# Altium schematic sheet GLV Precharge.SchDoc
size Tabloid; SheetNumber: 5; SheetTotal: 5
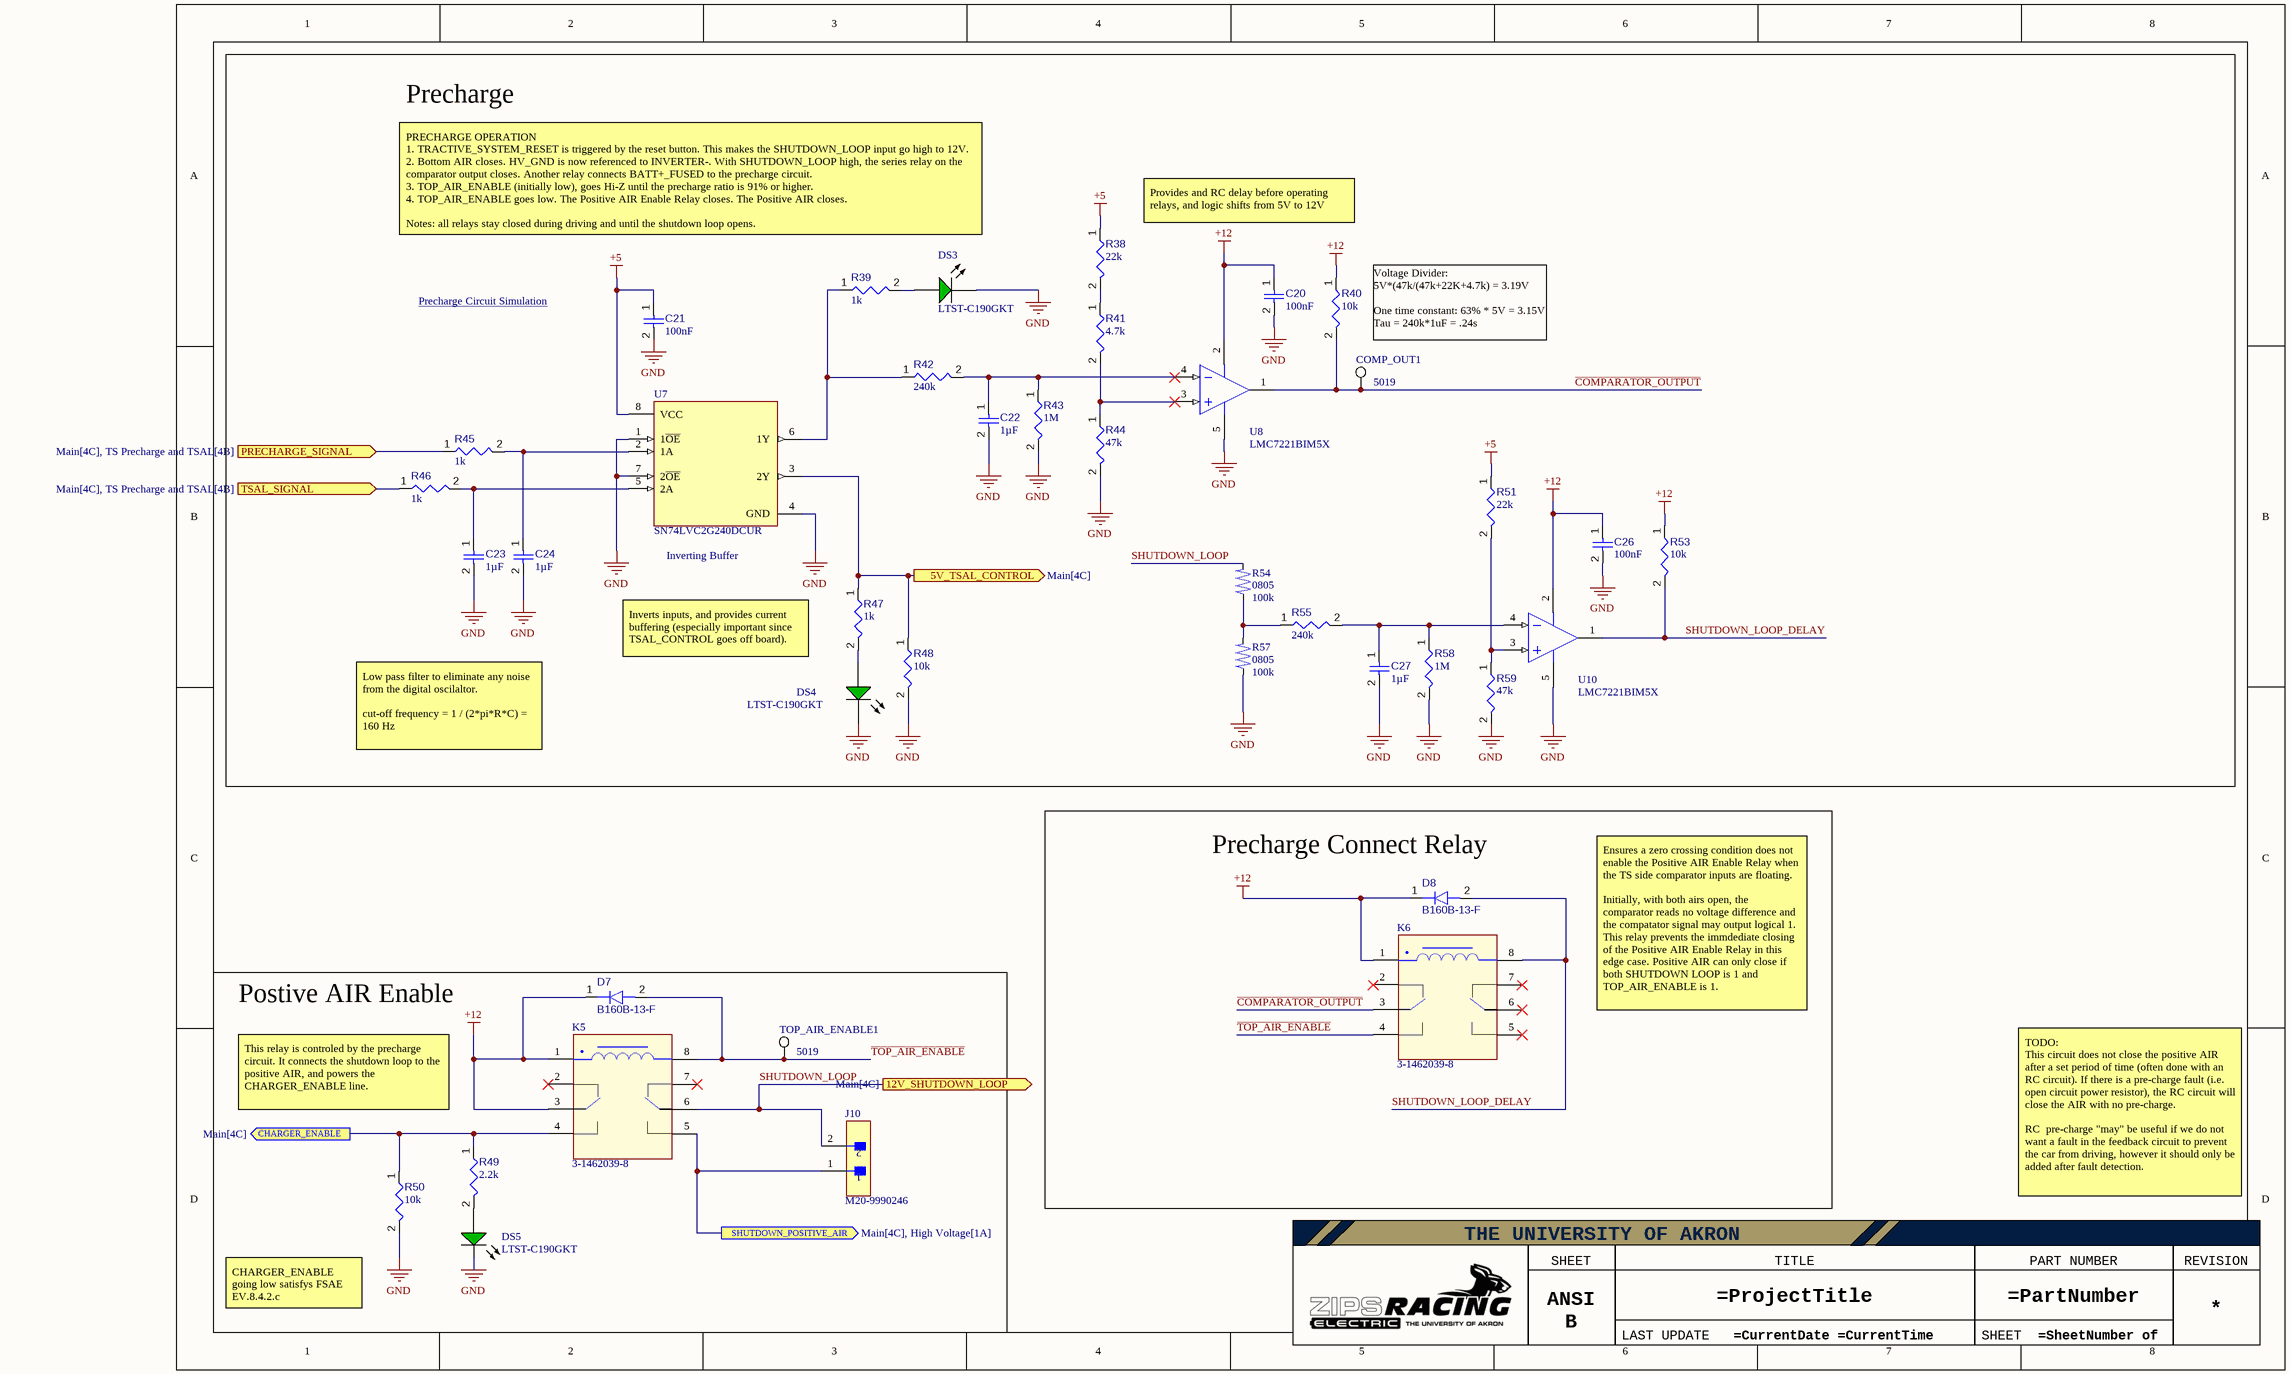
[diagram p0: GLV Precharge.SchDoc]

## Parts
C20  value 100nF  [CAPC1608X90X40NL10T20]  (hidden comment: Capacitor 100 nF +/-10% 50 V 0603)
C21  value 100nF  [CAPC1608X90X40NL10T20]  (hidden comment: Capacitor 100 nF +/-10% 50 V 0603)
C22  value 1µF  [CAPC1608X94X35NL15T15]  (hidden comment: Capacitor 1 uF +/- 10% 16 V 0603)
C23  value 1µF  [CAPC1608X94X35NL15T15]  (hidden comment: Capacitor 1 uF +/- 10% 16 V 0603)
C24  value 1µF  [CAPC1608X94X35NL15T15]  (hidden comment: Capacitor 1 uF +/- 10% 16 V 0603)
C26  value 100nF  [CAPC1608X90X40NL10T20]  (hidden comment: Capacitor 100 nF +/-10% 50 V 0603)
C27  value 1µF  [CAPC1608X94X35NL15T15]  (hidden comment: Capacitor 1 uF +/- 10% 16 V 0603)
COMP_OUT1  5019  [KSTN-5019_V]
D7  B160B-13-F  [FP-SMB-MFG]
D8  B160B-13-F  [FP-SMB-MFG]
DS3  LTST-C190GKT  [LTST-C190GKT_V]
DS4  LTST-C190GKT  [LTST-C190GKT_V]
DS5  LTST-C190GKT  [LTST-C190GKT_V]
J10  M20-9990246  [FP-M20-9990246-MFG]
K5  3-1462039-8  [FP-3-1462039-8-MFG]
K6  3-1462039-8  [FP-3-1462039-8-MFG]
R38  value 22k  [RESC1608X55X25LL10T15]  (hidden comment: Resistor 22k +/- 1% 0603 100 mW)
R39  value 1k  [RESC1608X55X25ML10T15]  (hidden comment: Resistor 1k +/-1% 0603 100 mW)
R40  value 10k  [RESC1608X55X25ML10T15]  (hidden comment: Resistor 10k +/-1% 0603 100 mW)
R41  value 4.7k  [RESC1608X55X25ML10T15]  (hidden comment: Resistor 4k7 +/-1% 0603 100 mW)
R42  value 240k  [RESC1608X55X30LL15T15]  (hidden comment: Resistor 240k +/-1% 0603 100 mW)
R43  value 1M  [RESC1608X55X25LL10T15]  (hidden comment: Resistor 1M +/- 1 % 0603 100mW)
R44  value 47k  [FP-RT0603-IPC_C]  (hidden comment: Resistor 47k +/-1% 0603 100 mW)
R45  value 1k  [RESC1608X55X25ML10T15]  (hidden comment: Resistor 1k +/-1% 0603 100 mW)
R46  value 1k  [RESC1608X55X25ML10T15]  (hidden comment: Resistor 1k +/-1% 0603 100 mW)
R47  value 1k  [RESC1608X55X25ML10T15]  (hidden comment: Resistor 1k +/-1% 0603 100 mW)
R48  value 10k  [RESC1608X55X25ML10T15]  (hidden comment: Resistor 10k +/-1% 0603 100 mW)
R49  value 2.2k  [RESC1608X55X25LL10T15]  (hidden comment: Resistor 2.2k +/-1% 0603 100mW)
R50  value 10k  [RESC1608X55X25ML10T15]  (hidden comment: Resistor 10k +/-1% 0603 100 mW)
R51  value 22k  [RESC1608X55X25LL10T15]  (hidden comment: Resistor 22k +/- 1% 0603 100 mW)
R53  value 10k  [RESC1608X55X25ML10T15]  (hidden comment: Resistor 10k +/-1% 0603 100 mW)
R54  value 100k  Footprint: 0805  [RES-0805-GENERIC]  (hidden comment: Resistor 100k 0805 1%)
R55  value 240k  [RESC1608X55X30LL15T15]  (hidden comment: Resistor 240k +/-1% 0603 100 mW)
R57  value 100k  Footprint: 0805  [RES-0805-GENERIC]  (hidden comment: Resistor 100k 0805 1%)
R58  value 1M  [RESC1608X55X25LL10T15]  (hidden comment: Resistor 1M +/- 1 % 0603 100mW)
R59  value 47k  [FP-RT0603-IPC_C]  (hidden comment: Resistor 47k +/-1% 0603 100 mW)
TOP_AIR_ENABLE1  5019  [KSTN-5019_V]
U7  SN74LVC2G240DCUR  [FP-DCU0008A-IPC_B]
U8  LMC7221BIM5X  [DBV0005A_L]
U10  LMC7221BIM5X  [DBV0005A_L]

## Blocks framed on the sheet
Precharge: C20-C24 C26 C27 COMP_OUT1 DS3 DS4 R38-R48 R51 R53-R55 R57-R59 U7 U8 U10
Precharge Connect Relay: D8 K6
Postive AIR Enable: D7 DS5 J10 K5 R49 R50 TOP_AIR_ENABLE1

## Ports
5V_TSAL_CONTROL (out, see Main[4C]), 12V_SHUTDOWN_LOOP (out, see Main[4C]), CHARGER_ENABLE (out, see Main[4C]), PRECHARGE_SIGNAL (in, see Main[4C], TS Precharge and TSAL[4B]), SHUTDOWN_POSITIVE_AIR (out, see Main[4C], High Voltage[1A]), TSAL_SIGNAL (in, see Main[4C], TS Precharge and TSAL[4B])

## Nets
+5: C21.1 R38.1 R51.1 U7.8(VCC)
+12: C20.1 C26.1 D7.1(K) D8.1(K) K5.1 K5.3 K6.1 R40.1 R53.1 U8.2(V+) U10.2(V+)
GND: C20.2 C21.2 C22.2 C23.2 C24.2 C26.2 C27.2 DS3.2(K) DS4.2(K) DS5.2(K) R43.2 R44.2 R48.2 R50.2 R57.1 R58.2 R59.2 U7.1(1~{OE}) U7.4(GND) U7.7(2~{OE}) U8.5(V-) U10.5(V-)
5V_TSAL_CONTROL: R47.1 R48.1 U7.3(2Y) ; port 5V_TSAL_CONTROL
~{COMPARATOR_OUTPUT}: COMP_OUT1.1 K6.3 R40.2 U8.1(OUT)
~{TOP_AIR_ENABLE}: D7.2(A) K5.8 K6.4 TOP_AIR_ENABLE1.1
CHARGER_ENABLE: K5.4 R49.1 R50.1 ; port CHARGER_ENABLE
PRECHARGE_SIGNAL: R45.1 ; port PRECHARGE_SIGNAL
SHUTDOWN_LOOP: J10.2 K5.6 R54.2 ; port 12V_SHUTDOWN_LOOP
SHUTDOWN_LOOP_DELAY: D8.2(A) K6.8 R53.2 U10.1(OUT)
SHUTDOWN_POSITIVE_AIR: J10.1 K5.5 ; port SHUTDOWN_POSITIVE_AIR
TSAL_SIGNAL: R46.1 ; port TSAL_SIGNAL
NetC22_1: C22.1 R42.2 R43.1 U8.4(IN-)
NetC23_1: C23.1 R46.2 U7.5(2A)
NetC24_1: C24.1 R45.2 U7.2(1A)
NetC27_1: C27.1 R55.2 R58.1 U10.4(IN-)
NetDS3_1: DS3.1(A) R39.2
NetDS4_1: DS4.1(A) R47.2
NetDS5_1: DS5.1(A) R49.2
NetR38_2: R38.2 R41.1
NetR39_1: R39.1 R42.1 U7.6(1Y)
NetR41_2: R41.2 R44.1 U8.3(IN+)
NetR51_2: R51.2 R59.1 U10.3(IN+)
NetR54_1: R54.1 R55.1 R57.2

Not connected (* = marked no-connect by the designer): K5 2* 7*; K6 2* 5* 6* 7*

## Notes on the sheet
- PRECHARGE OPERATION
  1. TRACTIVE_SYSTEM_RESET is triggered by the reset button. This makes the SHUTDOWN_LOOP input go high to 12V.
  2. Bottom AIR closes. HV_GND is now referenced to INVERTER-. With SHUTDOWN_LOOP high, the series relay on the comparator output closes. Another relay connects BATT+_FUSED to the precharge circuit.
  3. TOP_AIR_ENABLE (initially low), goes Hi-Z until the precharge ratio is 91% or higher.
  4. TOP_AIR_ENABLE goes low. The Positive AIR Enable Relay closes. The Positive AIR closes.
  Notes: all relays stay closed during driving and until the shutdown loop opens.
- Provides and RC delay before operating relays, and logic shifts from 5V to 12V
- Precharge Circuit Simulation <https://tinyurl.com/2y2tw88o>
- Voltage Divider:
  5V*(47k/(47k+22K+4.7k) = 3.19V
  One time constant: 63% * 5V = 3.15V
  Tau = 240k*1uF = .24s
- (near U7) Inverting Buffer
- Inverts inputs, and provides current buffering (especially important since TSAL_CONTROL goes off board).
- Low pass filter to eliminate any noise from the digital oscilaltor.
  cut-off frequency = 1 / (2*pi*R*C) = 160 Hz
- Ensures a zero crossing condition does not enable the Positive AIR Enable Relay when the TS side comparator inputs are floating.
  Initially, with both airs open, the comparator reads no voltage difference and the compatator signal may output logical 1. This relay prevents the immdediate closing of the Positive AIR Enable Relay in this edge case. Positive AIR can only close if both SHUTDOWN LOOP is 1 and TOP_AIR_ENABLE is 1.
- This relay is controled by the precharge circuit. It connects the shutdown loop to the positive AIR, and powers the CHARGER_ENABLE line.
- TODO:
  This circuit does not close the positive AIR after a set period of time (often done with an RC circuit). If there is a pre-charge fault (i.e. open circuit power resistor), the RC circuit will close the AIR with no pre-charge.
  RC  pre-charge "may" be useful if we do not want a fault in the feedback circuit to prevent the car from driving, however it should only be added after fault detection.
- CHARGER_ENABLE going low satisfys FSAE EV.8.4.2.c
- THE UNIVERSITY OF AKRON
- SHEET SIZE
- TITLE
- PART NUMBER
- REVISION
- ANSI B
- LAST UPDATE
- SHEET
- (in symbol CMP-008-00010-2) .

## Library data of the parts
C20 C21 C26 = CMP-001-00017-6: Chip Capacitor, 100 nF, +/- 10%, 50 V, 0603 (1608 Metric); Voltage Rating: 50V; Capacitor Type: Ceramic; Tolerance: 10%; Mounting Technology: SM; Max Operating Temperature: 125°C; RoHS Compliant: True; Pins: 2; Case/Package: 0603; Min Operating Temperature: -55°C
C22-C24 C27 = CMP-001-00003-6: Chip Capacitor, 1 uF, +/- 10%, 16 V, 0603 (1608 Metric); Voltage Rating: 16V; Capacitor Type: Ceramic; Max Operating Temperature: 125°C; Pins: 2; Tolerance: 10%; Min Operating Temperature: -55°C; RoHS Compliant: True; Mounting Technology: SM; Case/Package: 0603
COMP_OUT1 TOP_AIR_ENABLE1 = CMP-00012-1: Interconnection Device
D7 D8 = CMP-004-00032-1: Rectifier Diode, Schottky, 1 Phase, 1 Element, 1A, 60V V(RRM), Silicon; Forward Voltage: 700mV; Qualification Status: Not Qualified; RoHS Compliant: Yes; Surface Mount: Yes; Max Operating Temperature: 150°C; Max Output current: 1A; Min Operating Temperature: -65°C; Technology: SCHOTTKY; Pins: 2
DS3-DS5 = CMP-007-00022-2: LED Uni-Color Green, 100 mW, 30 mA, -55 to 85 degC, 2-Pin SMD, RoHS, Tape and Reel; Manufacturer: Lite-On; Power: 100mW; Forward Voltage: 2.1V; Viewing Angle: 130degrees; Forward Current: 20mA; Luminous Intensity: 6mcd; Lens Style: Clear; Manufacturer URL: http://www.us.liteon.com/; RoHS Compliant: True; Colour: Green; Package Description: 2-Pin Surface Mount Device, Body 1.6 x 0.8 mm; Datasheet URL: http://datasheet.octopart.com/LTST-C190GKT-Lite-On-datasheet-158530.pdf; Datasheet Version: Dec-06; Mounting Technology: SM; Case/Package: 0603; Package Reference: C190GKT; Packaging: TapeandReel; Min Operating Temperature: -55°C; Nominal Vf: 2.1V; Package Quantity: 3000; Illumination Colour: Green; Max Operating Temperature: 85°C; Pins: 2
J10 = CMP-00030-00002-1: Board Connector, 2 Contact(s), 1 Row(s), Male, Straight, 0.1 inch Pitch, Solder Terminal, Locking, Black Insulator; Number of Contacts: 2; Min Operating Temperature: -40°C; RoHS Compliant: Yes; Max Operating Temperature: 105°C; Mounting Technology: Board; Terminal Pitch: 2.54mm
K5 K6 = CMP-008-00010-2: Power/Signal Relay, 2 Form C, DPDT, Momentary, 0.01A (Coil), 12VDC (Coil), 140mW (Coil), 5A (Contact), 220VDC (Contact), DC Input, Random, AC/DC Output, Through Hole-Straight Mount; Operate Time: 3ms; Mounting Technology: Through-hole; Pins: 8; Max Operating Temperature: 85°C; Current Rating: 5A; Min Operating Temperature: -40°C; Contact Form: DPDT; RoHS Compliant: Yes; ComponentLink1URL: https://www.te.com/commerce/DocumentDelivery/DDEController?Action=srchrtrv&DocNm=108-98001&DocType=Data+Sheet&DocLang=English&DocFormat=pdf&PartCntxt=3-1462039-8; ComponentLink1Description: Datasheet
R38 R51 = CMP-009-00278-1: Fixed Resistor, Metal Glaze/thick Film, 0.1W, 22000ohm, 75V, 1% +/-Tol, 100ppm/Cel, Surface Mount, 0603; Power: 100mW; Rated Temperature: 70°C; Temperature Coefficient: 100ppm/°C; Pins: 2; RoHS Compliant: Yes; Max Operating Temperature: 155°C; Tolerance: 1%; Case/Package: 0603; Working Voltage: 75V; Min Operating Temperature: -55°C; Mounting Technology: Surface Mount
R39 R45-R47 = CMP-009-00014-5: Chip Resistor, 1 KOhm, +/-1%, 0.1 W, -55 to 155 degC, 0603 (1608 Metric); Voltage Rating: 50V; Power: 100mW; Tolerance: 1%; Mounting Technology: SM; Pins: 2; Case/Package: 0603; Min Operating Temperature: -55°C; RoHS Compliant: True; Max Operating Temperature: 155°C
R40 R48 R50 R53 = CMP-009-00017-5: Chip Resistor, 10 KOhm, +/- 1%, 01 W, -55 to 155 degC, 0603 (1608 Metric); Voltage Rating: 50V; Power: 100mW; RoHS Compliant: True; Min Operating Temperature: -55°C; Pins: 2; Case/Package: 0603; Mounting Technology: SM; Max Operating Temperature: 155°C; Tolerance: 1%
R41 = CMP-009-00031-5: Chip Resistor, 4.7 KOhm, +/- 1%, 0.1 W, -55 to 155 degC, 0603 (1608 Metric); Power: 100mW; Tolerance: 1%; Mounting Technology: SM; Case/Package: 0603; RoHS Compliant: True; Pins: 2; Min Operating Temperature: -55°C; Max Operating Temperature: 155°C
R42 R55 = CMP-009-00280-1: Fixed Resistor, Metal Glaze/thick Film, 0.1W, 240000ohm, 75V, 1% +/-Tol, 100ppm/Cel, Surface Mount, 0603; Temperature Coefficient: 100ppm/°C; Rated Temperature: 70°C; Power: 100mW; RoHS Compliant: Yes; Working Voltage: 75V; Case/Package: 0603; Mounting Technology: Surface Mount; Max Operating Temperature: 155°C; Min Operating Temperature: -55°C; Pins: 2; Tolerance: 1%
R43 R58 = CMP-009-00279-1: Fixed Resistor, Metal Glaze/thick Film, 0.1W, 1000000ohm, 75V, 1% +/-Tol, 100ppm/Cel, Surface Mount, 0603; Temperature Coefficient: 100ppm/°C; Rated Temperature: 70°C; RoHS Compliant: Yes; Tolerance: 1%; Max Operating Temperature: 155°C; Power: 100mW; Pins: 2; Working Voltage: 75V; Min Operating Temperature: -55°C; Mounting Technology: Surface Mount; Case/Package: 0603
R44 R59 = CMP-009-00281-1: Fixed Resistor, Thin Film, 0.1W, 47000ohm, 75V, 1% +/-Tol, 50ppm/Cel, Surface Mount, 0603; Rated Temperature: 70°C; Temperature Coefficient: 50ppm/°C; Power: 100mW; Min Operating Temperature: -55°C; Max Operating Temperature: 155°C; Case/Package: 0603; Tolerance: 1%; Working Voltage: 75V; RoHS Compliant: Yes; Mounting Technology: Surface Mount; Pins: 2
R49 = CMP-009-00198-1: Description Chip Resistor, 2.2 KOhm, +/-1%, 0.1 W, -55 to 155 degC, 0603 (1608 Metric); Temperature Coefficient: 100ppm/°C; Rated Temperature: 70°C; Tolerance: 1%; Working Voltage: 75V; Case/Package: 0603; Power: 100mW; Mounting Technology: Surface Mount; Min Operating Temperature: -55°C; Max Operating Temperature: 155°C; RoHS Compliant: Yes; Pins: 2
R54 R57 = CMP-00087-1: Resistor, 0805, 1%, 1/10W; Tolerance: 5%; Power: 125mW; Datasheet: https://www.seielect.com/catalog/sei-rmcf_rmcp.pdf; Min Operating Temperature: -55°C; Max Operating Temperature: 155°C
U7 = CMP-016-00022-1: Bus Driver, LVC/LCX/Z Series, 2-Func, 1-Bit, Inverted Output, CMOS, PDSO8; Nominal Supply Voltage: 3.3V; Min Supply Voltage: 1.65V; Max Supply Voltage: 5.5V; RoHS Compliant: Yes; Min Operating Temperature: -40°C; Logic Type: BUS DRIVER; Case/Package: VSSOP; Max Operating Temperature: 125°C; Pins: 8
U8 U10 = CMP-016-00012-2: Tiny CMOS Comparator with ail-to- ail Input and Open Drain Output 5-SOT-23 -40 to 85; Output Type: OPEN-DRAIN; Nominal Supply Voltage: 5V; Power Supplies: 2.7/15V; RoHS Compliant: No; Pins: 5; Case/Package: LSSOP; Technology: CMOS; Min Operating Temperature: -40°C; Surface Mount: Yes; Amplifier Type: COMPARATOR; Max Operating Temperature: 85°C